# Altium schematic sheet Sheet1.SchDoc
size Letter
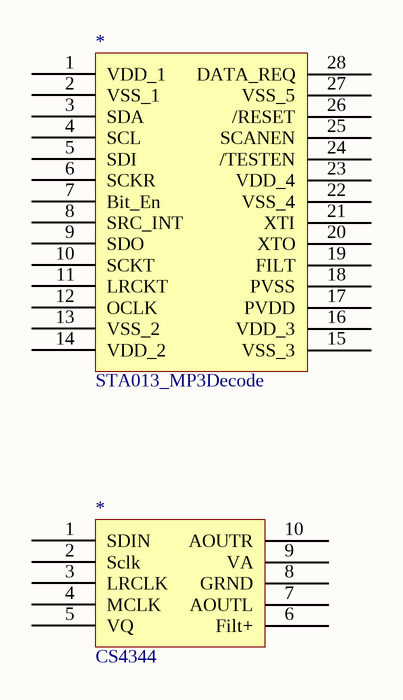
[diagram p0: Sheet1.SchDoc]

## Parts
(Parts that share a designator on the sheet are numbered #1, #2 ... from top to bottom, then left to right.)
*#1  STA013_MP3Decode  [SOP28]
*#2  CS4344  [TSSOP10 - duplicate1]

## Nets

Not connected (* = marked no-connect by the designer): *#1 1(VDD_1) 2(VSS_1) 3(SDA) 4(SCL) 5(SDI) 6(SCKR) 7(Bit_En) 8(SRC_INT) 9(SDO) 10(SCKT) 11(LRCKT) 12(OCLK) 13(VSS_2) 14(VDD_2) 15(VSS_3) 16(VDD_3) 17(PVDD) 18(PVSS) 19(FILT) 20(XTO) 21(XTI) 22(VSS_4) 23(VDD_4) 24(/TESTEN) 25(SCANEN) 26(/RESET) 27(VSS_5) 28(DATA_REQ); *#2 1(SDIN) 2(Sclk) 3(LRCLK) 4(MCLK) 5(VQ) 6(Filt+) 7(AOUTL) 8(GRND) 9(VA) 10(AOUTR)